# EAGLE design 2018-06-19 Shutters Signal Isolator (EAGLE 9.0.1)
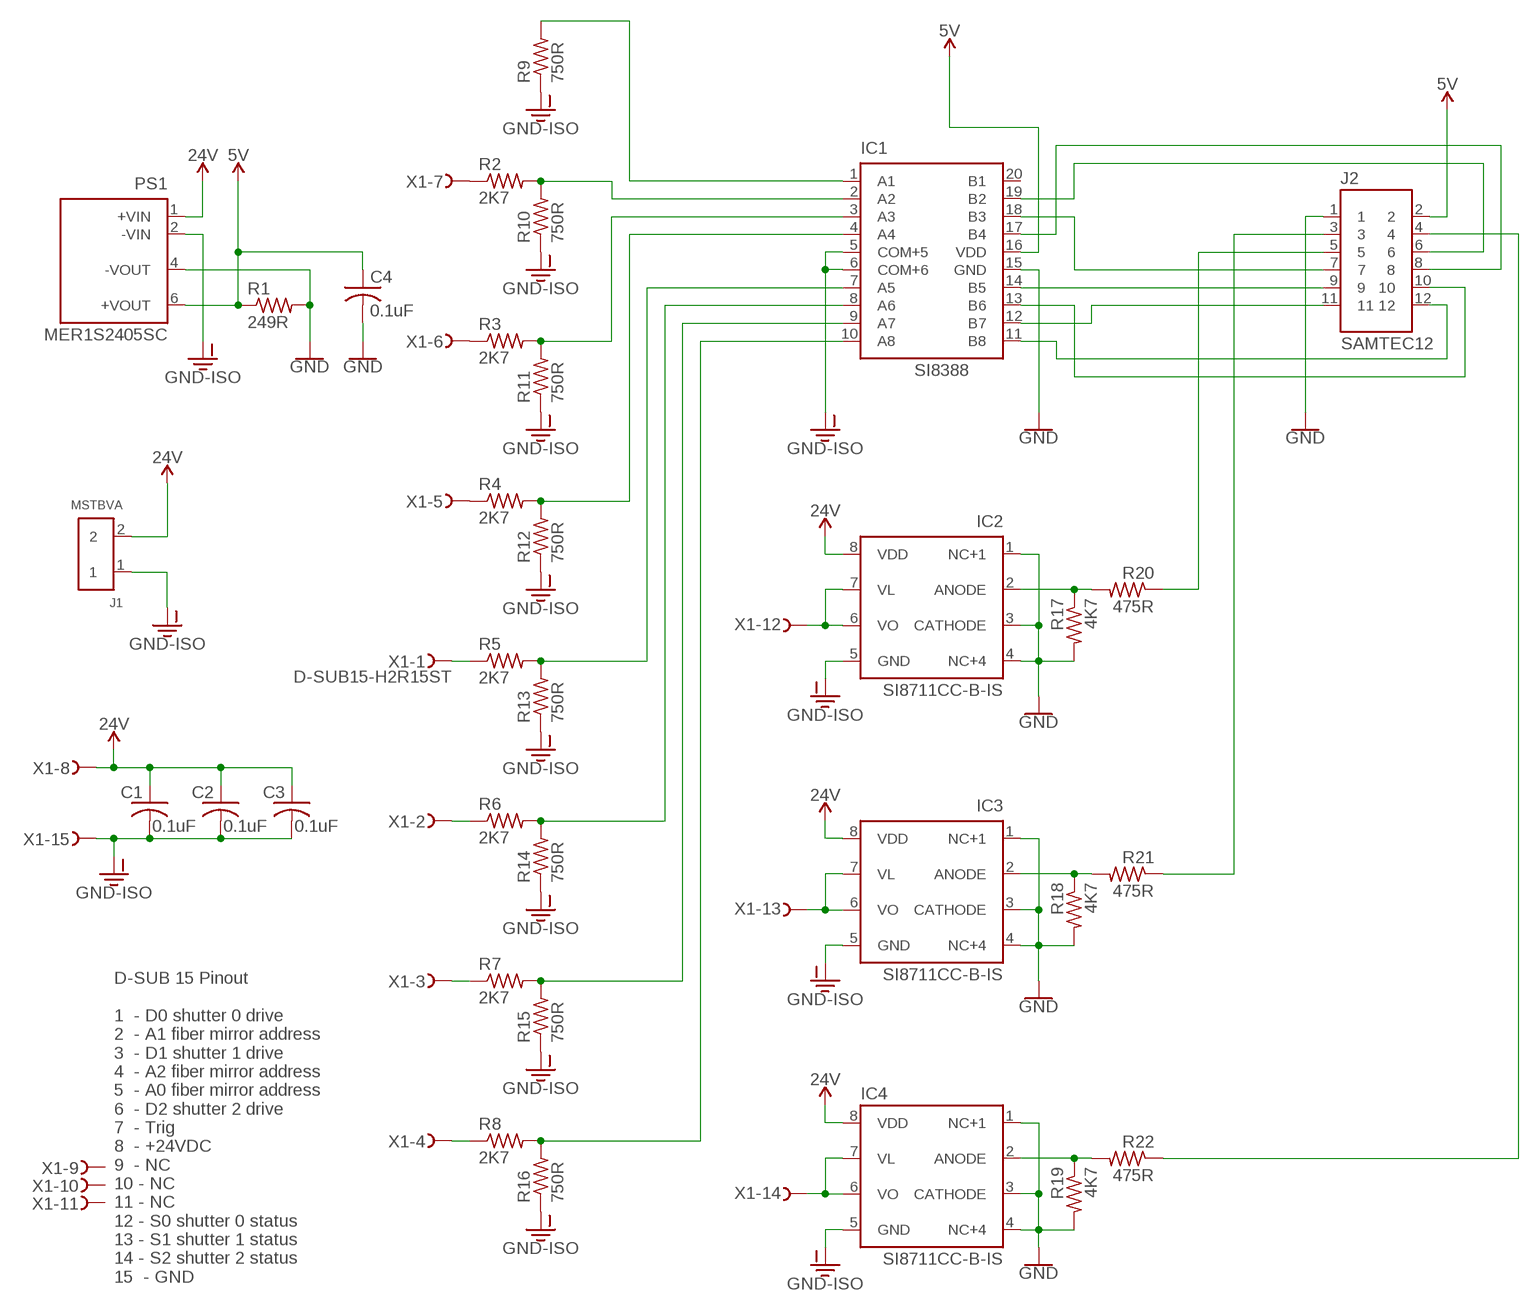
[diagram p0: schematic, sheet 1]

## Parts
C1  0.1uF  C-USC0805  [C0805]
C2  0.1uF  C-USC0805  [C0805]
C3  0.1uF  C-USC0805  [C0805]
C4  0.1uF  C-USC0805  [C0805]
IC1  SI8388  [20-QSOP]
IC2  SI8711CC-B-IS  [SO08]
IC3  SI8711CC-B-IS  [SO08]
IC4  SI8711CC-B-IS  [SO08]
J1  MSTBVA  [MSTBVA]
J2  SAMTEC12  [SAMTEC12]
PS1  MER1S2405SC  MER1  [MER1]
R1  249R  R-US_R0805  [R0805]
R2  2K7  R-US_R0805  [R0805]
R3  2K7  R-US_R0805  [R0805]
R4  2K7  R-US_R0805  [R0805]
R5  2K7  R-US_R0805  [R0805]
R6  2K7  R-US_R0805  [R0805]
R7  2K7  R-US_R0805  [R0805]
R8  2K7  R-US_R0805  [R0805]
R9  750R  R-US_R0805  [R0805]
R10  750R  R-US_R0805  [R0805]
R11  750R  R-US_R0805  [R0805]
R12  750R  R-US_R0805  [R0805]
R13  750R  R-US_R0805  [R0805]
R14  750R  R-US_R0805  [R0805]
R15  750R  R-US_R0805  [R0805]
R16  750R  R-US_R0805  [R0805]
R17  4K7  R-US_R0805  [R0805]
R18  4K7  R-US_R0805  [R0805]
R19  4K7  R-US_R0805  [R0805]
R20  475R  R-US_R0805  [R0805]
R21  475R  R-US_R0805  [R0805]
R22  475R  R-US_R0805  [R0805]
X1  D-SUB15-H2R15ST  [H2R15ST]

## Nets
5V [pwr]: C4.1 IC1.16(VDD) J2.2 PS1.6(+VOUT) R1.1
24V [pwr]: C1.1 C2.1 C3.1 IC2.8(VDD) IC3.8(VDD) IC4.8(VDD) J1.2 PS1.1(+VIN) X1.8
GND: C4.2 IC1.15(GND) IC2.1(NC+1) IC2.3(CATHODE) IC2.4(NC+4) IC3.1(NC+1) IC3.3(CATHODE) IC3.4(NC+4) IC4.1(NC+1) IC4.3(CATHODE) IC4.4(NC+4) J2.1 PS1.4(-VOUT) R1.2 R17.2 R18.2 R19.2
GND-ISO [pwr]: C1.2 C2.2 C3.2 IC1.5(COM+5) IC1.6(COM+6) IC2.5(GND) IC3.5(GND) IC4.5(GND) J1.1 PS1.2(-VIN) R9.1 R10.1 R11.1 R12.1 R13.1 R14.1 R15.1 R16.1 X1.15
N$1: IC4.2(ANODE) R19.1 R22.2
N$2: IC1.1(A1) R9.2
N$3: IC2.6(VO) IC2.7(VL) X1.12
N$4: IC1.2(A2) R2.2 R10.2
N$5: IC1.11(B8) J2.12
N$6: IC1.12(B7) J2.11
N$7: IC1.3(A3) R3.2 R11.2
N$8: IC1.13(B6) J2.10
N$9: IC1.14(B5) J2.9
N$10: IC1.19(B2) J2.6
N$11: IC1.17(B4) J2.8
N$12: IC1.18(B3) J2.7
N$13: R5.1 X1.1
N$14: IC1.4(A4) R4.2 R12.2
N$15: R6.1 X1.2
N$16: IC1.7(A5) R5.2 R13.2
N$17: R7.1 X1.3
N$18: IC1.8(A6) R6.2 R14.2
N$19: IC3.6(VO) IC3.7(VL) X1.13
N$20: IC4.6(VO) IC4.7(VL) X1.14
N$21: IC1.9(A7) R7.2 R15.2
N$22: IC1.10(A8) R8.2 R16.2
N$23: R8.1 X1.4
N$24: R4.1 X1.5
N$25: R3.1 X1.6
N$26: R2.1 X1.7
N$27: J2.3 R21.1
N$34: IC3.2(ANODE) R18.1 R21.2
N$36: IC2.2(ANODE) R17.1 R20.2
S$0: J2.5 R20.1
S$2: J2.4 R22.1
Unconnected: IC1.20(B1) X1.9 X1.10 X1.11

## Notes on the sheet
- D-SUB 15 Pinout
  
  1  - D0 shutter 0 drive
  2  - A1 fiber mirror address
  3  - D1 shutter 1 drive
  4  - A2 fiber mirror address
  5  - A0 fiber mirror address
  6  - D2 shutter 2 drive
  7  - Trig
  8  - +24VDC
  9  - NC
  10 - NC
  11 - NC
  12 - S0 shutter 0 status
  13 - S1 shutter 1 status
  14 - S2 shutter 2 status
  15  - GND

## Library data of the parts
C1-C4 = rcl:C-US: CAPACITOR, American symbol; SPICEPREFIX: C
IC1 = AU:SI8388: Si8388 Silicon Labs Digital Input 8-port 24V to 5V with isolation
IC2-IC4 = AU:SI8711CC-B-IS: Si8711CC-B-IS Optocoupler emulator, open collector output, integrated 20K pullup Digikey 336-2385-ND, $0.79 each
J1 = AU:MSTBVA: Phoenix Contact MSTBVA Vertical Terminal Block Phoenix order number 1755736 Digikey: 277-1150-ND Mating part is Phoneix Contact Combicon Spring Cage plug TFCK 5.08 mm pitch Digikey: 277-6941-ND
J2 = AU:SAMTEC12
PS1 = AU:MER1
R1-R22 = rcl:R-US_: RESISTOR, American symbol; SPICEPREFIX: R
X1 = con-thomas-betts:D-SUB15-: D-Subminiatur Connector Source: Electronioc Interconnects European Edition 1998; OC_FARNELL: unknown; OC_NEWARK: unknown

## Net classes
1 pwr: width 0.254 mm, clearance 0.254 mm

## Board
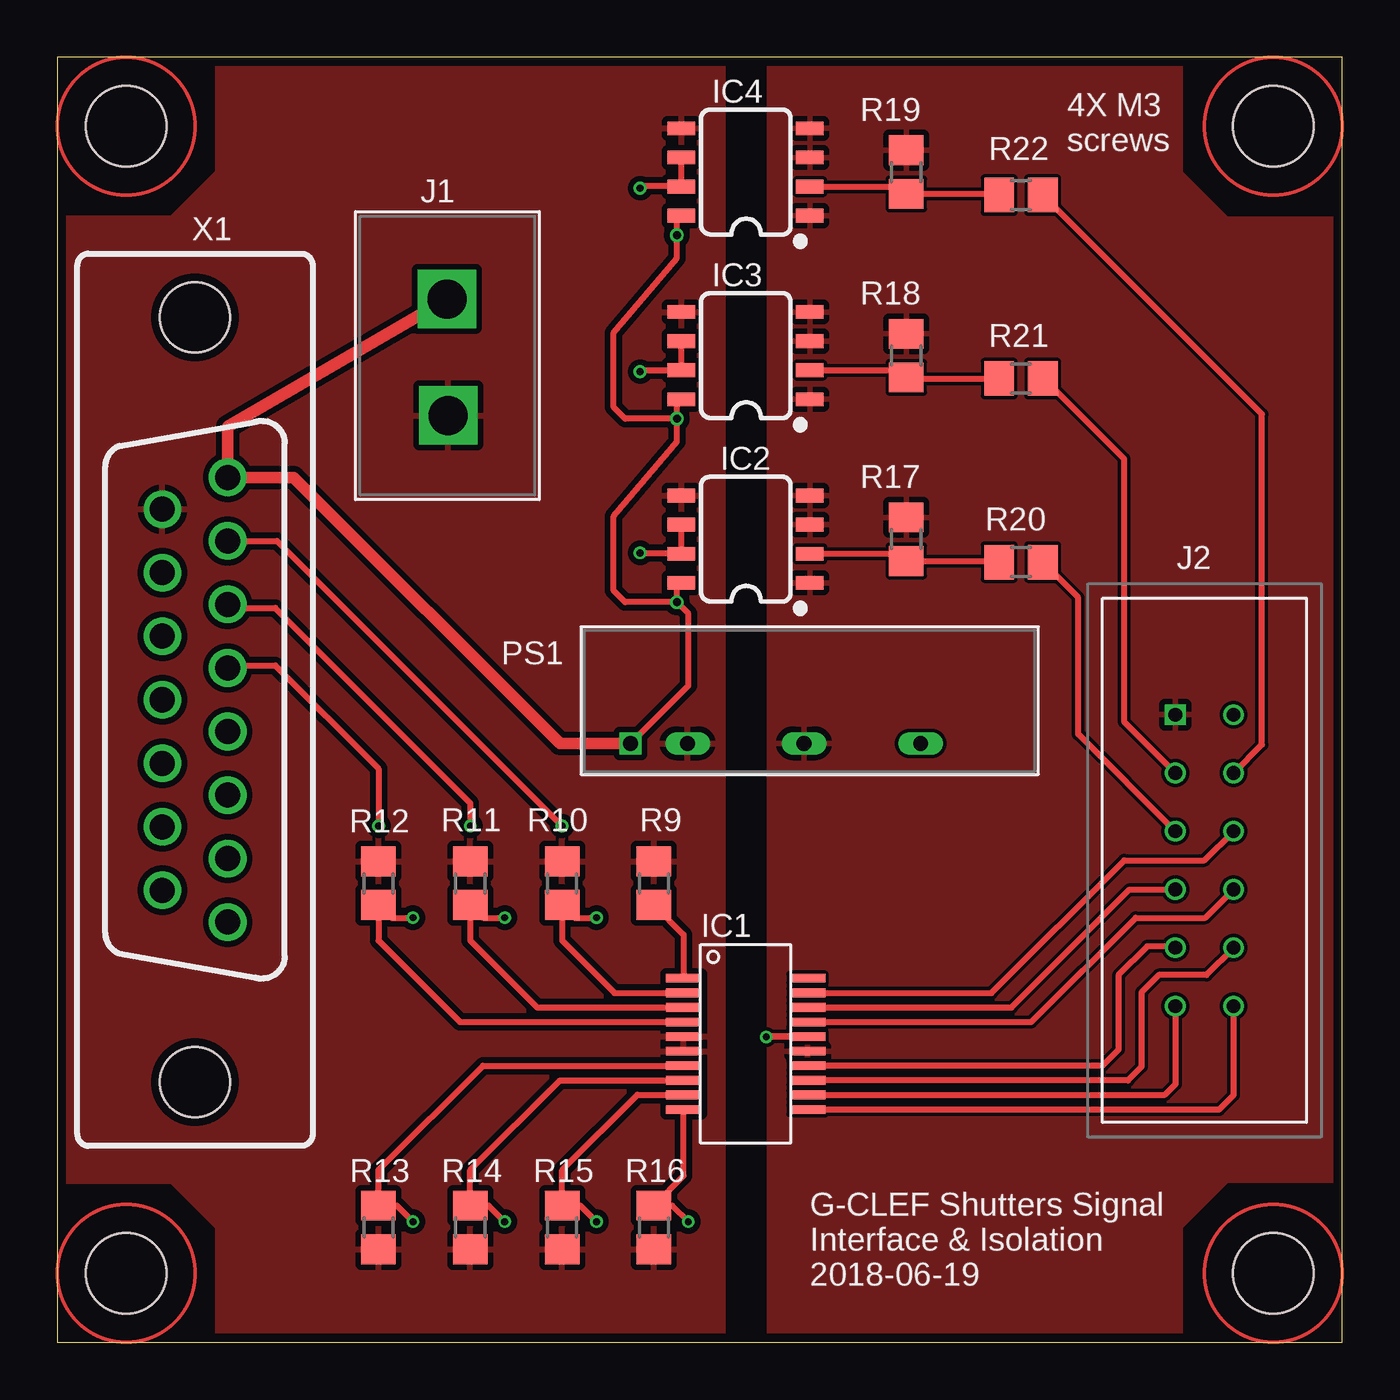
[diagram p1: board, top side]
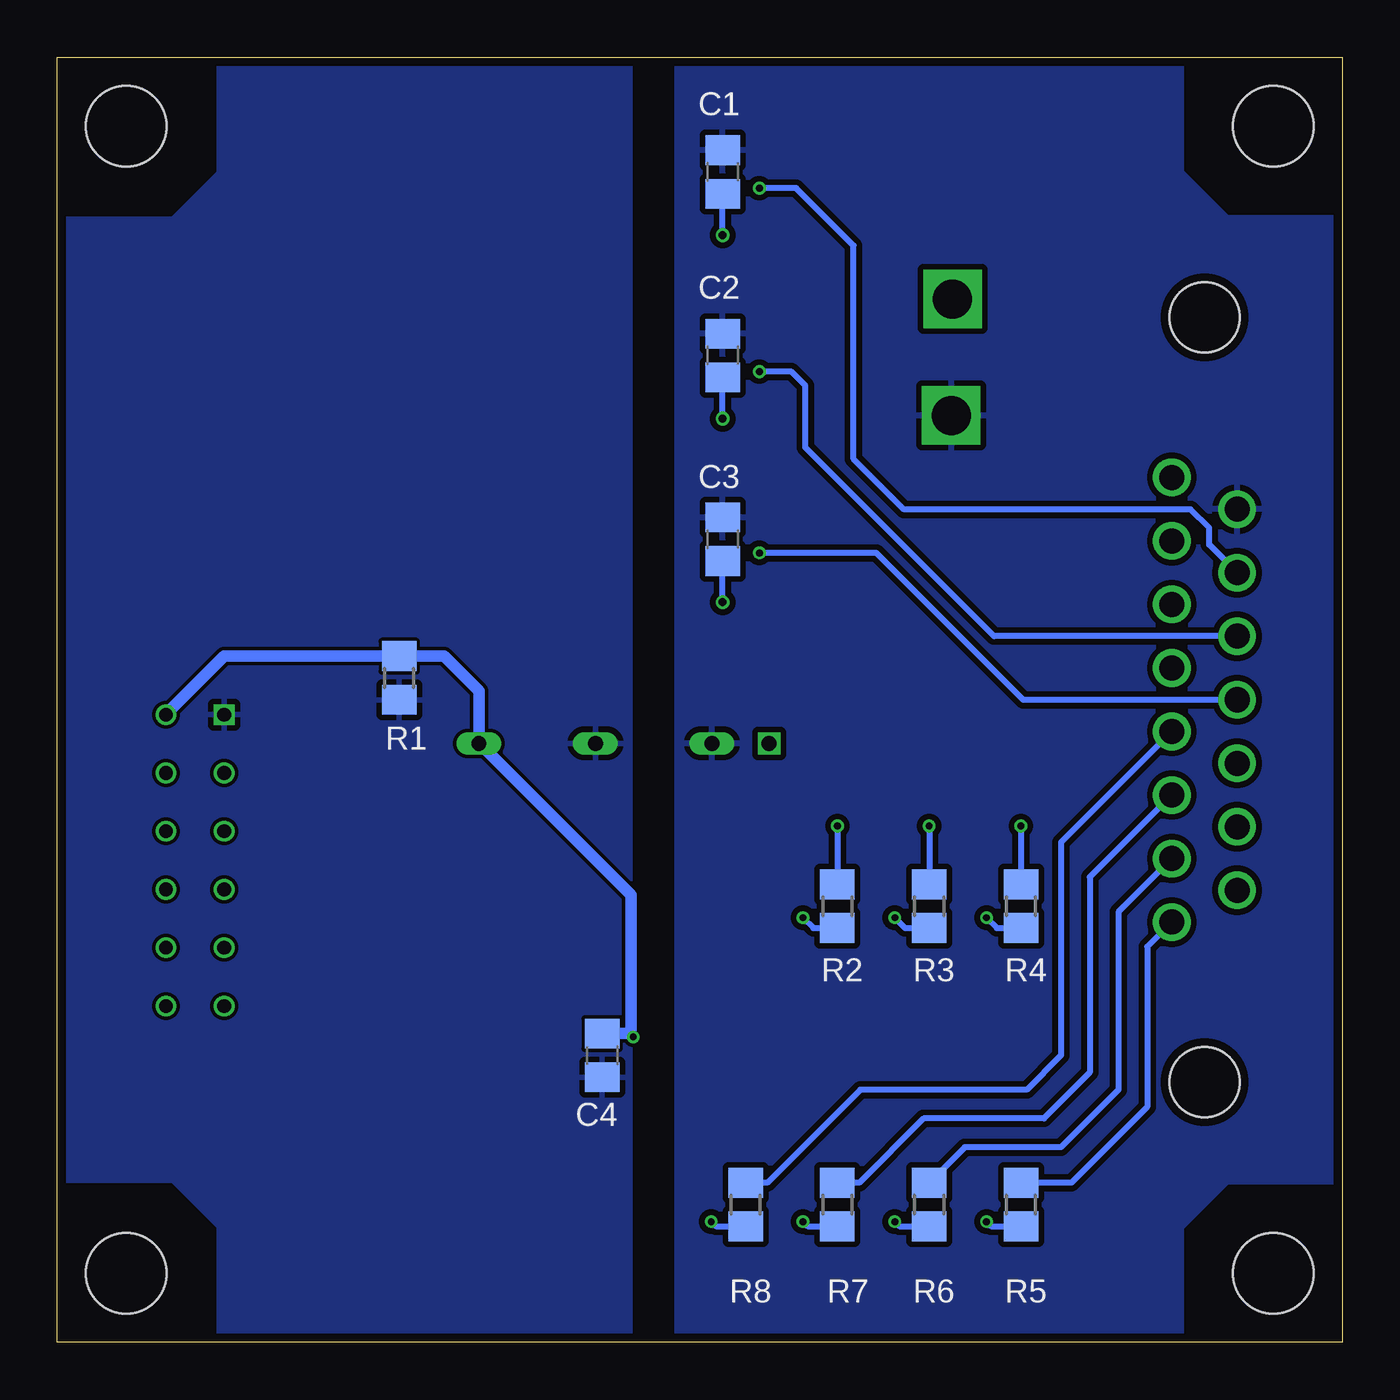
[diagram p2: board, bottom side, seen from below]

Size 56 x 56 mm. Coordinates in mm from the lower left corner, seen from the top.
Outline: 0,0 56,0 56,56 0,56 0,0
Copper layers (1*16): Top 0.035559375mm / dielectric 1.6mm / Bottom 0.035559375mm
Design rules "oshpark-2layer": minimum track width 6mil, minimum drill 10mil, track to track 6mil, track to pad 6mil, pad to pad 6mil, via to via 6mil, smd to smd 6mil, copper to edge 15mil, drill to drill 6mil, minimum pad ring 5mil, minimum via ring 5mil, stop-mask expansion 2.5mil, vias tented up to drill 0mil, thermal gap 10mil
Holes 3.5 mm at 3,3 3,53 53,53 53,3

### Footprints (pad centres in the part's own frame; a part is rotated, then mirrored left to right if it is on the bottom)
C0805 = smd 1.3 x 1.5: 1 -0.95,0; 2 0.95,0
20-QSOP = smd 1.55 x 0.38: 1 -2.7,2.86; 2 -2.7,2.22; 3 -2.7,1.59; 4 -2.7,0.95; 5 -2.7,0.32; 6 -2.7,-0.32; 7 -2.7,-0.95; 8 -2.7,-1.59; 9 -2.7,-2.22; 10 -2.7,-2.86; 11 2.7,-2.86; 12 2.7,-2.22; 13 2.7,-1.59; 14 2.7,-0.95; 15 2.7,-0.32; 16 2.7,0.32; 17 2.7,0.95; 18 2.7,1.59; 19 2.7,2.22; 20 2.7,2.86
SO08 = smd 0.6 x 1.2: 1 -1.905,-2.8; 2 -0.635,-2.8; 3 0.635,-2.8; 4 1.905,-2.8; 5 1.905,2.8; 6 0.635,2.8; 7 -0.635,2.8; 8 -1.905,2.8
MSTBVA = drill 1.7 square: 1 -2.61,-0.04; 2 2.47,0.02
SAMTEC12 = drill 0.6 square: 1 -1.27,6.35 | drill 0.6: 2 1.27,6.35; 3 -1.27,3.81; 4 1.27,3.81; 5 -1.27,1.27; 6 1.27,1.27; 7 -1.27,-1.27; 8 1.27,-1.27; 9 -1.27,-3.81; 10 1.27,-3.81; 11 -1.27,-6.35; 12 1.27,-6.35
MER1 = drill 0.65 square: 1 -7.62,-1.905 | drill 0.65 long: 2 -5.131,-1.905; 4 -0.051,-1.905; 6 5.029,-1.905
R0805 = smd 1.3 x 1.5: 1 -0.95,0; 2 0.95,0
H2R15ST = drill 1.092: 1 9.69,1.422; 2 6.921,1.422; 3 4.153,1.422; 4 1.384,1.422; 5 -1.384,1.422; 6 -4.153,1.422; 7 -6.921,1.422; 8 -9.69,1.422; 9 8.306,-1.422; 10 5.537,-1.422; 11 2.769,-1.422; 12 0,-1.422; 13 -2.769,-1.422; 14 -5.537,-1.422; 15 -8.306,-1.422 | hole 3.048: -16.662,0; 16.662,0

### Placement (x,y rotation side)
C1  27,51 90 bottom
C2  27,43 90 bottom
C3  27,35 90 bottom
C4  32.25,12.5 270 bottom
IC1  30,13 0 top
IC2  30,35 90 top
IC3  30,43 90 top
IC4  30,51 90 top
J1  17,43 90 top
J2  50,21 0 top
PS1  32.6,28 0 top
R1  41.1,28.95 270 bottom
R2  22,19 270 bottom
R3  18,19 270 bottom
R4  14,19 270 bottom
R5  14,6 270 bottom
R6  18,6 270 bottom
R7  22,6 270 bottom
R8  26,6 270 bottom
R9  26,20 270 top
R10  22,20 270 top
R11  18,20 270 top
R12  14,20 270 top
R13  14,5 90 top
R14  18,5 90 top
R15  22,5 90 top
R16  26,5 90 top
R17  37,35 90 top
R18  37,43 90 top
R19  37,51 90 top
R20  42,34 180 top
R21  42,42 180 top
R22  42,50 180 top
X1  6,28 270 top

### Tracks (layer width: path | path; a pad name or v marks a point on that pad's centre or on a via)
5V  (via drill 0.3)
  Top 0.305: IC1.16 v30.9,13.3
  Bottom 0.254: 31,13.4 v30.9,13.3 31.05,13.45 | 37.59,26.09 PS1.6
  Bottom 0.508: 31,13.4 31,19.5 37.59,26.09 | PS1.6 37.63,28.38 39.15,29.9 R1.1 48.72,29.9 J2.2 | 31.05,13.45 C4.1
24V  (via drill 0.35)
  Top 0.254: v27,32.25 27,32.9 IC2.8 | v27,40.25 27,40.9 IC3.8 | IC4.8 27,48.9 v27,48.25 27,47.25 24.25,44 24.25,40.75 24.75,40.25 v27,40.25 | v27,32.25 24.75,32.25 24.25,32.75 24.25,36 27,39.25 v27,40.25 | v27,32.25 27.5,31.75 27.5,28.61 PS1.1
  Top 0.508: J1.2 7.42,39.91 X1.8 10.31,37.69 21.91,26.09 PS1.1
  Bottom 0.254: v27,32.25 C3.1 | v27,40.25 C2.1 | v27,48.25 C1.1
GND
  Bottom 0.254: J2.1 48.65,27.35
  pour Top: 31,0 49,0 49,5 51,7 56,7 56,49 51,49 49,51 49,56 31,56
  pour Bottom: 31,0 49,0 49,5 51,7 56,7 56,49 51,49 49,51 49,56 31,56
GND-ISO
  pour Bottom: 7,5 5,7 0,7 0,49 5,49 7,51 7,56 29,56 29,0 7,0
  pour Top: 7,5 5,7 0,7 0,49 5,49 7,51 7,56 29,56 29,0 7,0
N$1
  Top 0.254: 36.59,50.37 R19.1 | R19.1 41,50.05 R22.2 | IC4.2 36.69,50.37 R19.1
N$2
  Top 0.254: R9.2 27.3,17.75 IC1.1
N$3  (via drill 0.3)
  Top 0.254: IC2.6 IC2.7 27.16,34.4 v25.4,34.4
  Bottom 0.254: X1.12 13.9,28 20.3,34.4 v25.4,34.4
N$4  (via drill 0.3)
  Top 0.254: IC1.2 24.28,15.22 22,17.5 R10.2 22.55,18.5 v23.5,18.5
  Bottom 0.254: v23.5,18.5 23.05,18.05 R2.2
N$5
  Top 0.254: IC1.11 50.64,10.14 51.27,10.77 J2.12
N$6
  Top 0.254: IC1.12 48.28,10.78 48.75,11.25 48.75,14.63 J2.11
N$7  (via drill 0.3)
  Top 0.254: IC1.3 20.91,14.59 18,17.5 R11.2 18.55,18.5 v19.5,18.5
  Bottom 0.254: v19.5,18.5 19.05,18.05 R3.2
N$8
  Top 0.254: J2.10 50.08,16 48,16 47.25,15.25 47.25,12 46.66,11.41 IC1.13
N$9
  Top 0.254: J2.9 48.67,17.25 47.5,17.25 46.25,16 46.25,12.75 45.55,12.05 IC1.14
N$10
  Top 0.254: IC1.19 40.72,15.22 46.5,21 50,21 J2.6
N$11
  Top 0.254: 32.75,14 IC1.17 42.45,13.95 47,18.5 50.04,18.5 J2.8
N$12
  Top 0.254: IC1.18 41.59,14.59 46.73,19.73 J2.7
N$13
  Bottom 0.254: X1.1 8.5,17.23 8.5,10.25 11.8,6.95 R5.1
N$14  (via drill 0.3)
  Top 0.254: IC1.4 17.55,13.95 14,17.5 R12.2 14.55,18.5 v15.5,18.5
  Bottom 0.254: v15.5,18.5 15.05,18.05 R4.2
N$15
  Bottom 0.254: X1.2 9.75,18.75 9.75,11 12.25,8.5 16.45,8.5 R6.1
N$16  (via drill 0.3)
  Top 0.254: IC1.7 18.55,12.05 14,7.5 R13.2 14.8,5.95 v15.5,5.25
  Bottom 0.254: v15.5,5.25 15.3,5.05 R5.2
N$17
  Bottom 0.254: X1.3 11,20.27 11,11.75 13,9.75 18.25,9.75 21.05,6.95 R7.1
N$18  (via drill 0.3)
  Top 0.254: IC1.8 21.91,11.41 18,7.5 R14.2 18.8,5.95 v19.5,5.25
  Bottom 0.254: v19.5,5.25 19.3,5.05 R6.2
N$19  (via drill 0.3)
  Top 0.254: IC3.6 IC3.7 25.46,42.37 v25.4,42.3
  Bottom 0.254: v25.4,42.3 24,42.3 23.4,41.7 23.4,39 15.17,30.77 X1.13
N$20  (via drill 0.3)
  Top 0.254: IC4.6 IC4.7 27.16,50.4 25.5,50.4 v25.4,50.3
  Bottom 0.254: X1.14 5.8,34.76 5.8,35.5 6.6,36.3 19.1,36.3 21.3,38.5 21.3,47.8 23.8,50.3 v25.4,50.3
N$21  (via drill 0.3)
  Top 0.254: IC1.9 25.28,10.78 22,7.5 R15.2 22.8,5.95 v23.5,5.25
  Bottom 0.254: v23.5,5.25 23.3,5.05 R7.2
N$22  (via drill 0.3)
  Top 0.254: R16.2 27.3,7.25 IC1.10 | R16.2 26.05,6 | R16.2 26.8,5.95 v27.5,5.25
  Bottom 0.254: v27.5,5.25 27.3,5.05 R8.2
N$23
  Bottom 0.254: X1.4 12.25,21.79 12.25,12.5 13.75,11 21,11 25.05,6.95 R8.1
N$24  (via drill 0.3)
  Top 0.254: X1.5 7.54,29.5 9.5,29.5 14,25 v14,22.5
  Bottom 0.254: v14,22.5 R4.1
N$25  (via drill 0.3)
  Top 0.254: X1.6 7.58,32 9.5,32 18,23.5 v18,22.5
  Bottom 0.254: v18,22.5 R3.1
N$26  (via drill 0.3)
  Top 0.254: X1.7 9.58,34.92 v22,22.5
  Bottom 0.254: v22,22.5 R2.1
N$27
  Top 0.254: J2.3 46.5,27.04 46.5,38.5 43,42 R21.1
N$34
  Top 0.254: R21.2 37.05,42 R18.1 36.69,42.37 IC3.2
N$36
  Top 0.254: R20.2 41,34.05 R17.1 36.69,34.37 IC2.2
S$0
  Top 0.254: J2.5 44.5,26.5 44.5,32.45 R20.1
S$2
  Top 0.254: J2.4 52.5,26.04 52.5,40.45 R22.1
(copper drawn outside any net)
  shapes: Top circle x4

### Text on the board
tPlace: 4X M3 / screws | G-CLEF Shutters Signal / Interface & Isolation / 2018-06-19